# Altium schematic sheet Modelo-1.SchDoc
size A4
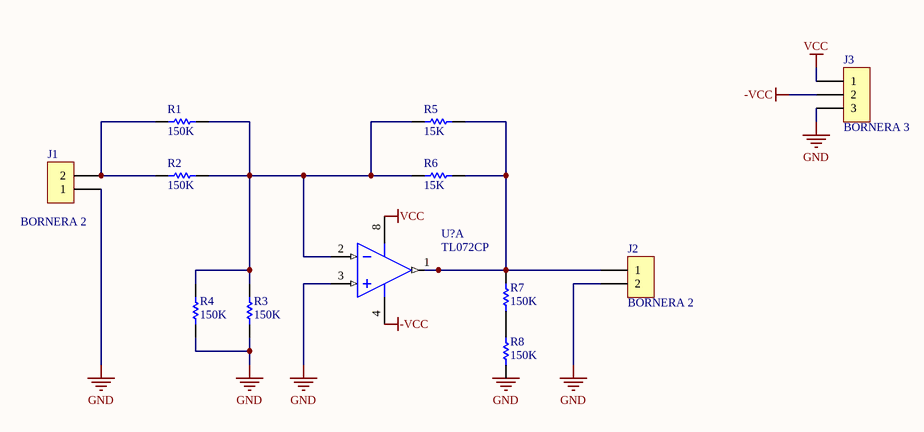
[diagram p0: Modelo-1.SchDoc]

## Parts
J1  BORNERA 2  [BORNERA2]
J2  BORNERA 2  [BORNERA2]
J3  BORNERA 3  [BORNERA3]
R1  150K  [RES400]
R2  150K  [RES400]
R3  150K  [RES400]
R4  150K  [RES400]
R5  15K  [RES400]
R6  15K  [RES400]
R7  150K  [RES400]
R8  150K  [RES400]
U?  TL072CP  [TI-P8]  (part A of 2)

## Nets
-VCC: J3.2 U?.4(VCC-)
GND: J1.1 J2.2 J3.3 R3.1 R4.1 U?.3(IN1+)
VCC: J3.1 U?.8(VCC+)
NetJ1_2: J1.2 R1.1 R2.1
NetJ2_1: J2.1 R5.2 R6.1 R7.1 U?.1(OUT1)
NetR1_2: R1.2 R2.2 R3.2 R4.2 R5.1 R6.2 U?.2(IN1-)
NetR7_2: R7.2 R8.2

Not connected (* = marked no-connect by the designer): R8 1

## Notes on the sheet
- Labels drawn without touching a wire or pin: GND

## Library data of the parts
R1-R8 = RES
U? = TL072CP: Dual Low-Noise JFET-Input General-Purpose Operational Amplifier, 7 to 36 V, 0 to 70 degC, 8-pin DIP (P8), Pb-Free (RoHS); Manufacturer: Texas Instruments; CMRR(Min)(dB): 70; GBW(Typ)(MHz): 3; IIB(Max)(pA): 200; Iq per channel(Max)(mA): 2.5; Number of Channels: 2; Offset Drift(Typ)(uV/C): 18; Rating: Catalog; Slew Rate(Typ)(V/us): 13; Sub Family: General Purpose Amplifier, High Supply Voltage Amplifier (>=30V); Total Supply Voltage(Max)(+5V is 5, +/-5V is 10): 36; Total Supply Voltage(Min)(+5V is 5, +/-5V is 10): 7; Vio (25C)(Max)(mV): 10; DatasheetVersion: SLOS080J; PackageVersion: 4040082/E, 04/2010; PackageReference: P8; PackageDescription: 8-Pin Plastic In-Line, Body 9.59 x 6.35 mm, Pitch 2.54 mm; Supplier 1: Digi-Key; Supplier Part Number 1: 296-1775-5-ND; Supplier 2: Farnell; Supplier Part Number 2: 1106015; Supplier 3: Newark; Supplier Part Number 3: 60K6988; Supplier 4: Mouser; Supplier Part Number 4: 595-TL072CP; Eco-Plan: Pb-Free (RoHS); Vn at 1kHz(Typ)(nV/rtHz): 18; Mounting Technology: Through Hole; Code_JEDEC: MS-001; PartNumber: TL072CP; ComponentLink1Description: Manufacturer URL; ComponentLink1URL: http://www.ti.com/; ComponentLink2Description: Datasheet; ComponentLink2URL: http://www.ti.com/lit/ds/symlink/tl072.pdf; ComponentLink3Description: Package Specification; ComponentLink3URL: http://www.ti.com/litv/pdf/mpdi001b